# Altium schematic sheet [03] - HV Input.SchDoc
size A3
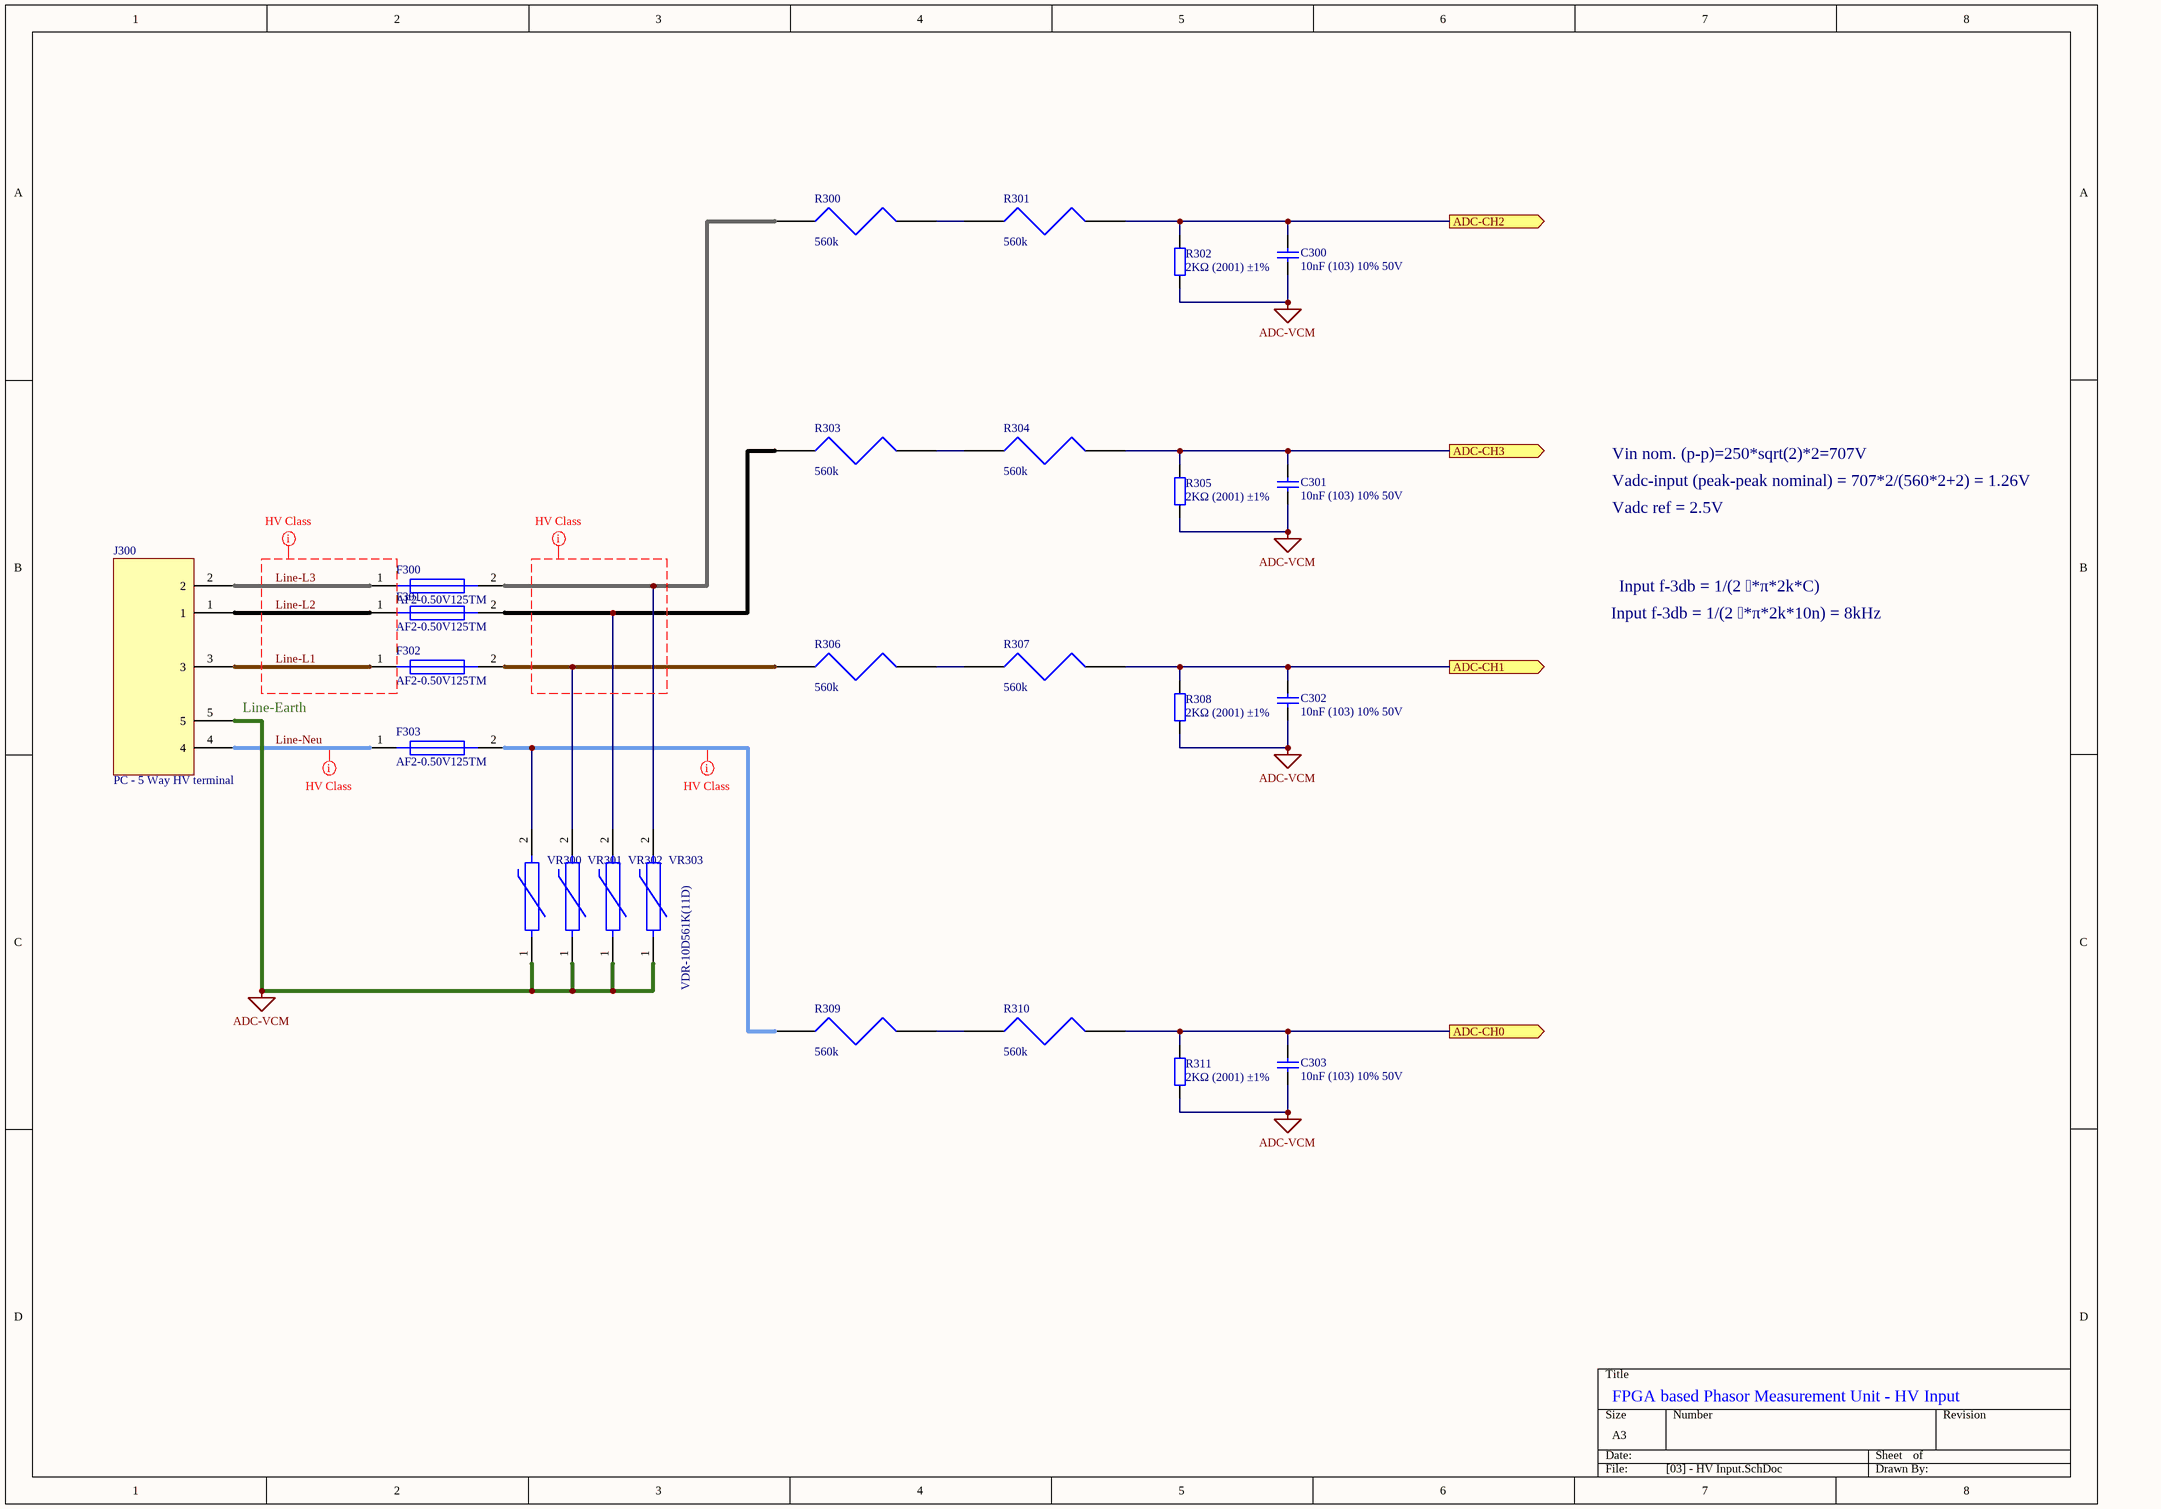
[diagram p0: [03] - HV Input.SchDoc]

## Parts
C300  10nF (103) 10% 50V  [0805_C]
C301  10nF (103) 10% 50V  [0805_C]
C302  10nF (103) 10% 50V  [0805_C]
C303  10nF (103) 10% 50V  [0805_C]
F300  AF2-0.50V125TM  [2410 Fuse]
F301  AF2-0.50V125TM  [2410 Fuse]
F302  AF2-0.50V125TM  [2410 Fuse]
F303  AF2-0.50V125TM  [2410 Fuse]
J300  PC - 5 Way HV terminal  [1017517]
R300  560k  [2512_HV_RES]
R301  560k  [2512_HV_RES]
R302  2KΩ (2001) ±1%  [0805_R]
R303  560k  [2512_HV_RES]
R304  560k  [2512_HV_RES]
R305  2KΩ (2001) ±1%  [0805_R]
R306  560k  [2512_HV_RES]
R307  560k  [2512_HV_RES]
R308  2KΩ (2001) ±1%  [0805_R]
R309  560k  [2512_HV_RES]
R310  560k  [2512_HV_RES]
R311  2KΩ (2001) ±1%  [0805_R]
VR300  VDR-10D561K(11D)  [VDR-10D561K(11D)]  (value not drawn)
VR301  VDR-10D561K(11D)  [VDR-10D561K(11D)]  (value not drawn)
VR302  VDR-10D561K(11D)  [VDR-10D561K(11D)]  (value not drawn)
VR303  VDR-10D561K(11D)  [VDR-10D561K(11D)]

## Ports
ADC-CH0 (out), ADC-CH1 (out), ADC-CH2 (out), ADC-CH3 (out)

## Nets
ADC-VCM: C300.1 C301.1 C302.1 C303.1 J300.5 R302.1 R305.1 R308.1 R311.1 VR300.1 VR301.1 VR302.1 VR303.1
ADC-CH0: C303.2 R310.2 R311.2 ; port ADC-CH0
ADC-CH1: C302.2 R307.2 R308.2 ; port ADC-CH1
ADC-CH2: C300.2 R301.2 R302.2 ; port ADC-CH2
ADC-CH3: C301.2 R304.2 R305.2 ; port ADC-CH3
Line-L1: F302.1 J300.3
Line-L2: F301.1 J300.1
Line-L3: F300.1 J300.2
Line-Neu: F303.1 J300.4
NetF300_2: F300.2 R300.1 VR303.2
NetF301_2: F301.2 R303.1 VR302.2
NetF302_2: F302.2 R306.1 VR301.2
NetF303_2: F303.2 R309.1 VR300.2
NetR300_2: R300.2 R301.1
NetR303_2: R303.2 R304.1
NetR306_2: R306.2 R307.1
NetR309_2: R309.2 R310.1

## Layout directives
net class HV: (no net found under the mark), Line-L1, Line-L2, Line-L3, Line-Neu, NetF303_2

## Notes on the sheet
- Vin nom. (p-p)=250*sqrt(2)*2=707V
- Vadc-input (peak-peak nominal) = 707*2/(560*2+2) = 1.26V
- Vadc ref = 2.5V
- Input f-3db = 1/(2 *π*2k*C)
- Input f-3db = 1/(2 *π*2k*10n) = 8kHz
- (near J300) Line-Earth
- FPGA based Phasor Measurement Unit - HV Input

## Library data of the parts
C300-C303 = 0805 10nF (103) 10% 50V: 贴片电容; ComponentLink1Description: 供应商链接; ComponentLink1URL: http://www.szlcsc.com/product/details_2062.html; Package: 0805; Supplier: LC; SuppliersPartNumber: C1710
F300-F303 = AF2-0.50V125TM: Chip Fuse Fast Blow 500mA 231mΩ 100A AC，50A DC 0.1 2410 Surface Mount Fuses RoHS; SuppliersPartNo: C311009; JLCPCB: NO
J300 = PC - 5 Way HV terminal: TDPT 4/ 5-SC-6,35-ZB - 1017517; JLCPCB: NO
R300 R301 R303 R304 R306 R307 R309 R310 = HR2512F560KE04Z: HIGH VOLTAGE RESISTOR 560KOHMS ±1% 1W 2512 ROHS; Value: 560k; Supplier: LCSC; SuppliersPartNumber: C175529
R302 R305 R308 R311 = 0805 2KΩ (2001) 1%: 贴片电阻; ComponentLink1Description: 供应商链接; ComponentLink1URL: http://www.szlcsc.com/product/details_18292.html; Package: 0805; Supplier: LC; SuppliersPartNumber: C17604
VR300-VR303 = VDR-10D561K(11D): 460V 920V 2.5KA 560V Through Hole Varistors RoHS; SuppliersPartNo: C283943; JLCPCB: NO